# EAGLE design Production_Rev_A (EAGLE 9.1.3)
Battlab-One Production Rev. A 4/2020
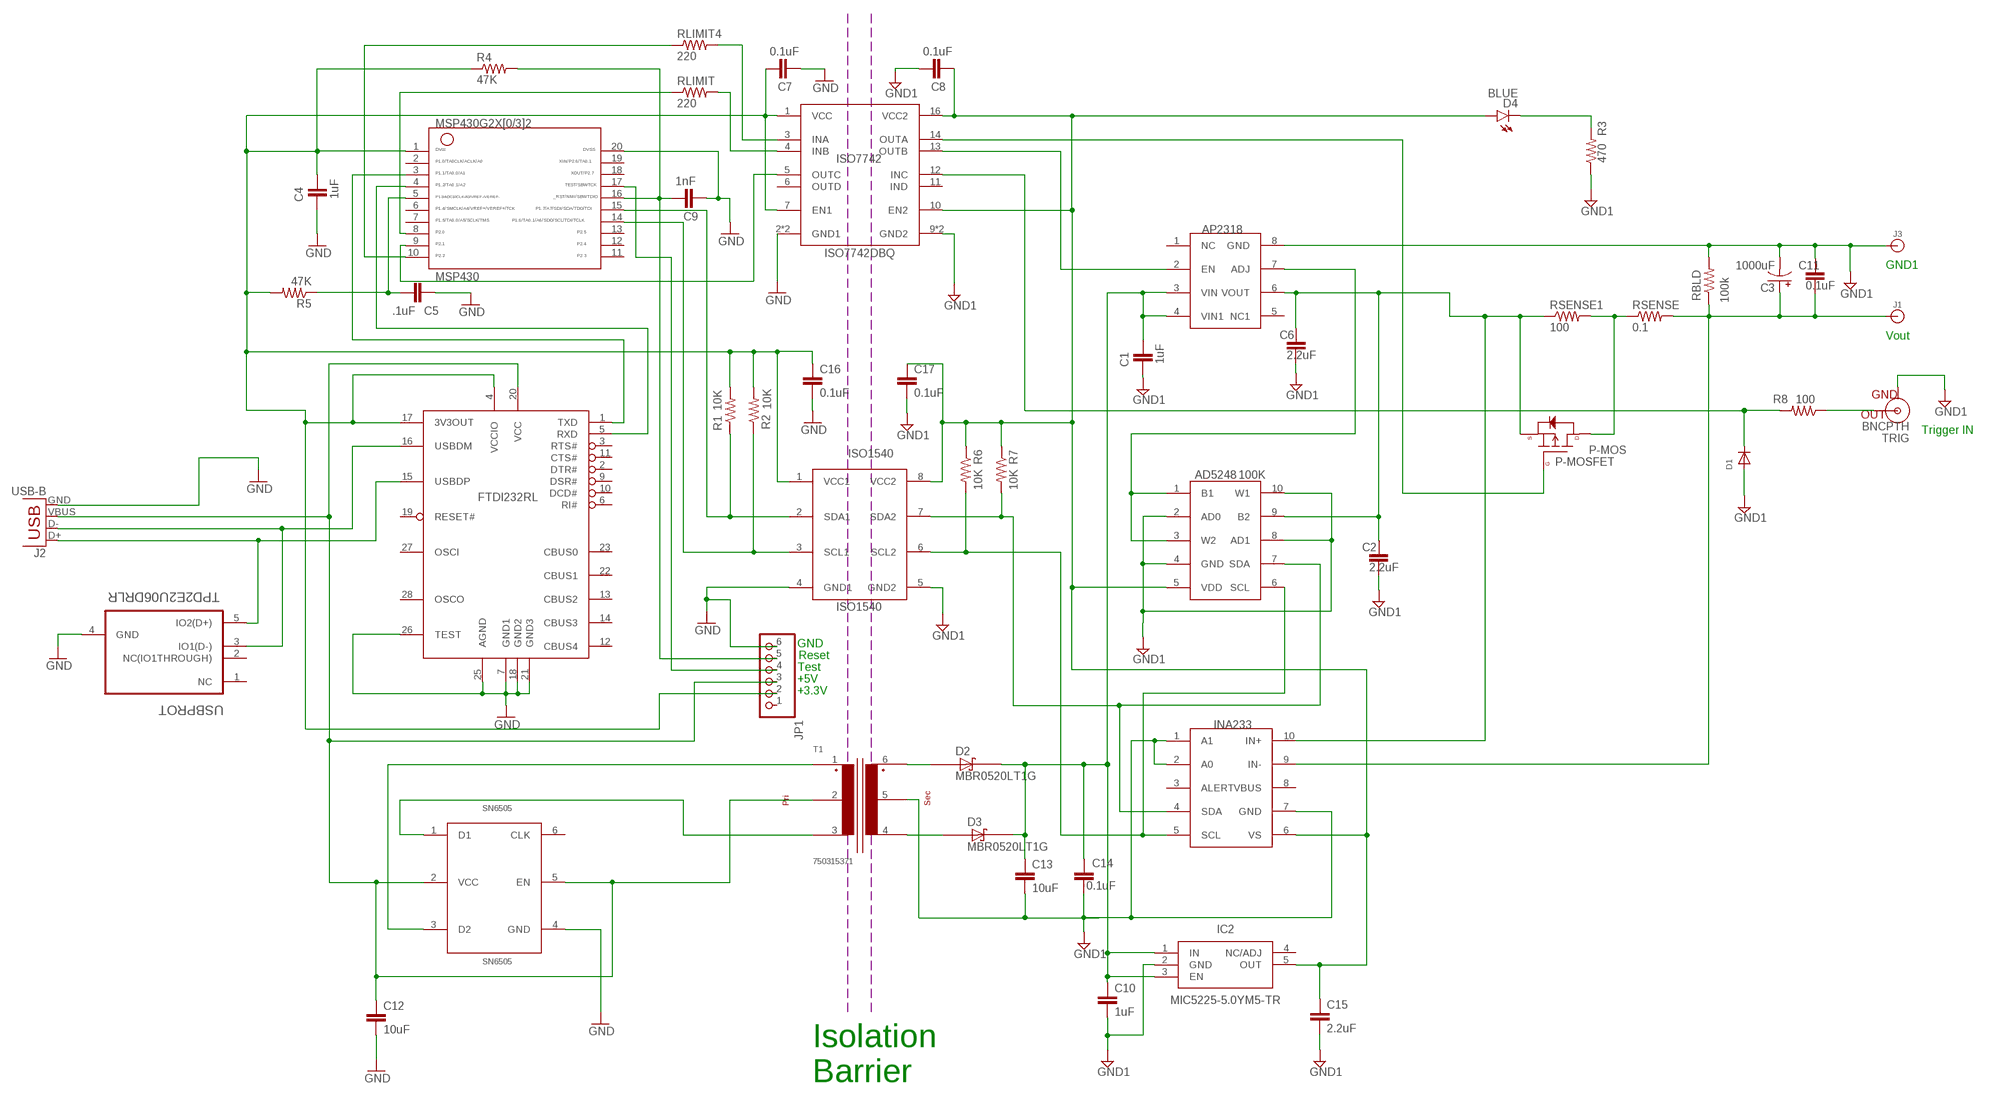
[diagram p0: schematic, sheet 1]

## Parts
AD5248  100K  AD5248  [MSOP-10]
AP2318  AP2318  [SOIC-8]
C1  1uF  CAP1206  [1206]
C2  2.2uF  CAP1206  [1206]
C3  1000uF  CPOL-USF  [PANASONIC_F]
C4  1uF  CAP1206  [1206]
C5  .1uF  CAP1206  [1206]
C6  2.2uF  CAP1206  [1206]
C7  0.1uF  CAP1206  [1206]
C8  0.1uF  CAP1206  [1206]
C9  1nF  CAP1206  [1206]
C10  1uF  CAP1206  [1206]
C11  0.1uF  CAP1206  [1206]
C12  10uF  CAP1206  [1206]
C13  10uF  CAP1206  [1206]
C14  0.1uF  CAP1206  [1206]
C15  2.2uF  CAP1206  [1206]
C16  0.1uF  CAP1206  [1206]
C17  0.1uF  CAP1206  [1206]
D1  DIODESOD-123  [SOD-123]
D2  MBR0520LT1G  [SOD3716X117(SOD-123)]
D3  MBR0520LT1G  [SOD3716X117(SOD-123)]
D4  BLUE  LED-BLUE1206  [LED-1206]
FTDI232RL  FT232RL  [SSOP28DB]
IC2  MIC5225-5.0YM5-TR  [SOT95P280X130-5N]
INA233  INA233  [VSSOP-10]
ISO1540  ISO1540  [SOIC127P600X175-8N]
ISO7742  ISO7742DBQ  [SOP63P599X175-16N]
J1  BANANA_CONN  [BANANA_CONN]
J2  USB-B  USBPTH  [USB-B-PTH]
J3  BANANA_CONN  [BANANA_CONN]
JP1  PINHD-1X6  [1X06]
MSP430  MSP430  G2X[0/3]2---PW20  [PW20]
P-MOS  P-MOSFET  P-CHANNEL-MOSFET  [SOT23-3]
R1  10K  RESISTOR1206  [1206]
R2  10K  RESISTOR1206  [1206]
R3  470  RESISTOR1206  [1206]
R4  47K  RESISTOR1206  [1206]
R5  47K  RESISTOR1206  [1206]
R6  10K  RESISTOR1206  [1206]
R7  10K  RESISTOR1206  [1206]
R8  100  RESISTOR1206  [1206]
RBLD  100k  RESISTOR1206  [1206]
RLIMIT  220  RESISTOR1206  [1206]
RLIMIT4  220  RESISTOR1206  [1206]
RSENSE  0.1  RESISTOR1206  [1206]
RSENSE1  100  RESISTOR1206  [1206]
SN6505  SN6505  [SOT95P280X145-6N]
T1  750315371  [TOR-6P-HT4_SMT_6PIN_(1201)]
TRIG  BNCPTH  [BNC]
USBPROT  TPD2E2U06DRLR  [SOT50P160X60-5N]

## Nets
3.3V: C4.2 C7.2 C16.1 FTDI232RL.4(VCCIO) FTDI232RL.17(3V3OUT) ISO1540.1(VCC1) ISO7742.1(VCC) ISO7742.7(EN1) JP1.2 MSP430.1 R1.2 R2.2 R4.1 R5.2
+5V_LDO: AD5248.5(VDD) C8.1 C15.1 C17.1 D4.A IC2.5(OUT) INA233.6(VS) ISO1540.8(VCC2) ISO7742.10(EN2) ISO7742.16(VCC2) R6.1 R7.1
GND: C4.1 C5.1 C7.1 C9.1 C12.2 C16.2 FTDI232RL.7(GND1) FTDI232RL.18(GND2) FTDI232RL.21(GND3) FTDI232RL.25(AGND) FTDI232RL.26(TEST) ISO1540.4(GND1) ISO7742.2(GND1) ISO7742.8(GND1) J2.GND JP1.6 MSP430.20 SN6505.4(GND) USBPROT.4(GND)
GND1: AD5248.2(AD0) AD5248.4(GND) AD5248.8(AD1) AD5248.10(W1) AP2318.8(GND) C1.1 C2.2 C3.- C6.2 C8.2 C10.2 C11.1 C13.2 C14.2 C15.2 C17.2 D1.A IC2.2(GND) INA233.1(A1) INA233.2(A0) INA233.7(GND) ISO1540.5(GND2) ISO7742.9(GND2) ISO7742.15(GND2) J3.P$1 R3.1 RBLD.2 T1.5 TRIG.GND
LDO_EN: ISO7742.4(INB) RLIMIT.2
LDO_EN1: MSP430.8 RLIMIT.1
LDO_EN2: AP2318.2(EN) ISO7742.13(OUTB)
N$4: P-MOS.3(D) RSENSE1.2 RSENSE.1
N$8: AP2318.3(VIN) AP2318.4(VIN1) C1.2 C10.1 C13.1 C14.1 D2.1(C) D3.1(C) IC2.1(IN) IC2.3(EN)
N$10: D3.2(A) T1.4
N$12: D2.2(A) T1.6
N$21: AD5248.1(B1) AD5248.3(W2) AP2318.7(ADJ)
N$29: D4.C R3.2
N$38: R8.1 TRIG.S(OUT)
RESET: C9.2 JP1.5 MSP430.16 R4.2
RS_EN: MSP430.10 RLIMIT4.1
RS_EN1: ISO7742.3(INA) RLIMIT4.2
RS_EN2: ISO7742.14(OUTA) P-MOS.1(G)
SCL1: ISO1540.3(SCL1) MSP430.14 R2.1
SCL2: AD5248.6(SCL) INA233.5(SCL) ISO1540.6(SCL2) R6.2
SDA1: ISO1540.2(SDA1) MSP430.15 R1.1
SDA2: AD5248.7(SDA) INA233.4(SDA) ISO1540.7(SDA2) R7.2
TEST: JP1.4 MSP430.17
TRANS1: SN6505.3(D2) T1.1
TRANS3: SN6505.1(D1) T1.3
TRIGGER_MSP1: ISO7742.5(OUTC) MSP430.9
TRIGGER_MSP2: D1.C ISO7742.12(INC) R8.2
UART_RX: FTDI232RL.5(RXD) MSP430.4
UART_TX: FTDI232RL.1(TXD) MSP430.3
USB+: FTDI232RL.15(USBDP) J2.D+ USBPROT.5(IO2(D+))
USB-: FTDI232RL.16(USBDM) J2.D- USBPROT.3(IO1(D-))
V_OUT: AD5248.9(B2) AP2318.6(VOUT) C2.1 C6.1 INA233.10(IN+) P-MOS.2(S) RSENSE1.1
VBUS+5V: C12.1 FTDI232RL.20(VCC) J2.VBUS JP1.3 SN6505.2(VCC) SN6505.5(EN) T1.2
VOUT: C3.+ C11.2 INA233.9(IN-) J1.P$1 RBLD.1 RSENSE.2
VREF: C5.2 MSP430.5 R5.1
Unconnected: AP2318.1(NC) AP2318.5(NC1) FTDI232RL.2(DTR#) FTDI232RL.3(RTS#) FTDI232RL.6(RI#) FTDI232RL.9(DSR#) FTDI232RL.10(DCD#) FTDI232RL.11(CTS#) FTDI232RL.12(CBUS4) FTDI232RL.13(CBUS2) FTDI232RL.14(CBUS3) FTDI232RL.19(RESET#) FTDI232RL.22(CBUS1) FTDI232RL.23(CBUS0) FTDI232RL.27(OSCI) FTDI232RL.28(OSCO) IC2.4(NC/ADJ) INA233.3(ALERT) INA233.8(VBUS) ISO7742.6(OUTD) ISO7742.11(IND) JP1.1 MSP430.2 MSP430.6 MSP430.7 MSP430.11 MSP430.12 MSP430.13 MSP430.18 MSP430.19 SN6505.6(CLK) USBPROT.2(NC(IO1THROUGH))

## Notes on the sheet
- GND1
- Vout
- Trigger IN
- GND
- Reset
- Test
- +5V
- +3.3V
- Isolation
  Barrier

## Power pins joined to a net without a drawn wire
NC: USBPROT.1(NC)

## Library data of the parts
AD5248 = BluebirdLabs:AD5248
AP2318 = BluebirdLabs:AP2318
C1 C2 C4-C17 = SparkFun-Capacitors:CAP: Capacitor Standard 0603 ceramic capacitor, and 0.1" leaded capacitor.
C3 = adafruit:CPOL-US: POLARIZED CAPACITOR, American symbol
D1 = adafruit:DIODE: Diode SMADIODE - SMA Surface Mount Package 20V 1A Schottky Diode Digikey: 641-1014-6-ND DO-1N4148 - Through Hole Small Current Diode SOD-123 20V 1 A (.5mV Vf) Schottky Diode - Digikey: MBRX120TPMSCT-ND SOD-323 10V 570mA (.38mV Vf, 3ns) Schottky Diode - Digikey: ZLLS410CT-ND SOD-523 30V 30mA Schottky Diode (RB751S-40TE61) - Digikey: RB751S-40TE61CT-ND SOT23-R/W - SOT23 Package (R = Solder Paste/Reflow Ovens, W = Hand-Soldering) BAT54Film 40V 300mA - Digikey: 497-7162-1-ND
D2 D3 = MBR0520LT1G:MBR0520LT1G: Surface Mount Schottky Power Rectifier Plastic SOD−123 Package; AVAILABILITY: Unavailable; DESCRIPTION: sod, pin, process, Schottky Diodes, repetitive, voltage, polarity, reflow, leaded, diode, Diodes, plastic, current, s...; MF: ON Semiconductor; MP: MBR0520LT1G; PACKAGE: SOD-123 Motorola; PRICE: None
D4 = SparkFun-LED:LED-BLUE: Blue LEDs for production use Various blue LEDs stocked by SparkFun production 0603 - DIO-08575 Rebel - DIO-09553 1206 - DIO-09911; PROD_ID: DIO-09911
FTDI232RL = ftdichip-6:FT232RL: USB UART 4th Generation USB UART (USB <-> Serial) Controller
IC2 = MIC5225-5.0YM5-TR:MIC5225-5.0YM5-TR: MICROCHIP - MIC5225-5.0YM5-TR - LDO VOLT REG, 0.15A, 5V, SOT-23-5 <https://componentsearchengine.com/Images/9/MIC5225-5.0YM5-TR.jpg> Source: Datasheet <http://ww1.microchip.com/downloads/en/DeviceDoc/mic5225.pdf>; AVAILABILITY: Unavailable; DESCRIPTION: Linear Voltage Regulator IC 1 Output 150mA SOT-23-5; MF: Microchip; MP: MIC5225-5.0YM5-TR; PACKAGE: SOT-23-5 Microchip; PRICE: None
INA233 = BluebirdLabs:INA233: Texas Instruments current measurement
ISO1540 = SOIC127P600X175-8N:ISO1540
ISO7742 = ISO7742DBQ:ISO7742DBQ: High-Efficiency, Low-Emissions, Reinforced Digital Isolator With Integrated Power 16-SOIC -40 to 125; AVAILABILITY: Unavailable; DESCRIPTION: ISO7742DBQ; MF: Texas Instruments; MP: ISO7742DBQ; PACKAGE: SSOP-16 Texas Instruments; PRICE: None
J1 J3 = SparkFun-Connectors:BANANA_CONN: Through-hole banana jack
J2 = SparkFun-Connectors:USB: USB Connectors USB-B-PTH is fully proven SKU : PRT-00139/CONN-08278 USB-miniB is fully proven SKU : PRT-00587 USB-A-PCB is untested. USB-A-H is throughly reviewed, but untested. Spark Fun Electronics SKU : PRT-00437 USB-B-SMT is throughly reviewed, but untested. Needs silkscreen touching up. USB-A-S has not been used/tested USB-MB-H has not been used/tested USB-MICROB has been used. CONN-09505; PROD_ID: CONN-08278
JP1 = adafruit:PINHD-1X6: PIN HEADER
MSP430 = TI_MSP430_v16:G2X[0/3]2---PW20: MSP430G2X[0/3]2 MSP430G2x32, MSP430G2x02 TSSOP (PW) 20 Pin Package http://focus.ti.com/docs/prod/folders/print/msp430g2432.html
P-MOS = GeekAmmo:P-CHANNEL-MOSFET: P-Channel MOSFET Mode Field Effect Transistor
R1-R8 RBLD = SparkFun-Passives:RESISTOR: Resistor Basic schematic elements and footprints for 0603, 1206, and PTH resistors.
RLIMIT RLIMIT4 RSENSE RSENSE1 = SparkFun-Resistors:RESISTOR: Resistor Basic schematic elements and footprints for 0603, 1206, and PTH resistors.
SN6505 = SN6505:SN6505
T1 = 750315371:750315371: Package Style: TOR-6P-HT4 Mounting: SMT Pins: 6 pins Bobbin: 250-1201 Best pinouts for production vary per application. Please contact Wurth Electronics Midcom, Inc. for assistance with your custom design. Website: Wurth Electronics Midcom <http://www.we-online.com/midcom> Contact us Wurth Electronics Midcom, Inc. 121 Airport Dr. Watertown, SD 57201 Phone: (605) 886-4385 Fax: (605) 886-4486 E-Mail: midcom@we-online.com; AVAILABILITY: Unavailable; DESCRIPTION: Xfrmr Fwd p-p Dc/Dc Conv Smd; MF: Wurth Electronics; MP: 750315371; PACKAGE: Wurth Electronics; PRICE: None
TRIG = SparkFun-Connectors:BNC: BNC Connector, Mouser Part# 5227161
USBPROT = TPD2E2U06DRLR:TPD2E2U06DRLR: LOW-CAPACITANCE 2-CHANNEL ±25kv contact and +/-30kv air gap protection for USB2.0, ethernet, MIPI, LVDS, and I2C TESTED; AVAILABILITY: Unavailable; DESCRIPTION: Dual-Channel High-Speed ESD Protection 5-SOT -40 to 125; MF: Texas Instruments; MP: TPD2E2U06DRLR; PACKAGE: SOT-553 Texas Instruments; PRICE: None

## Board
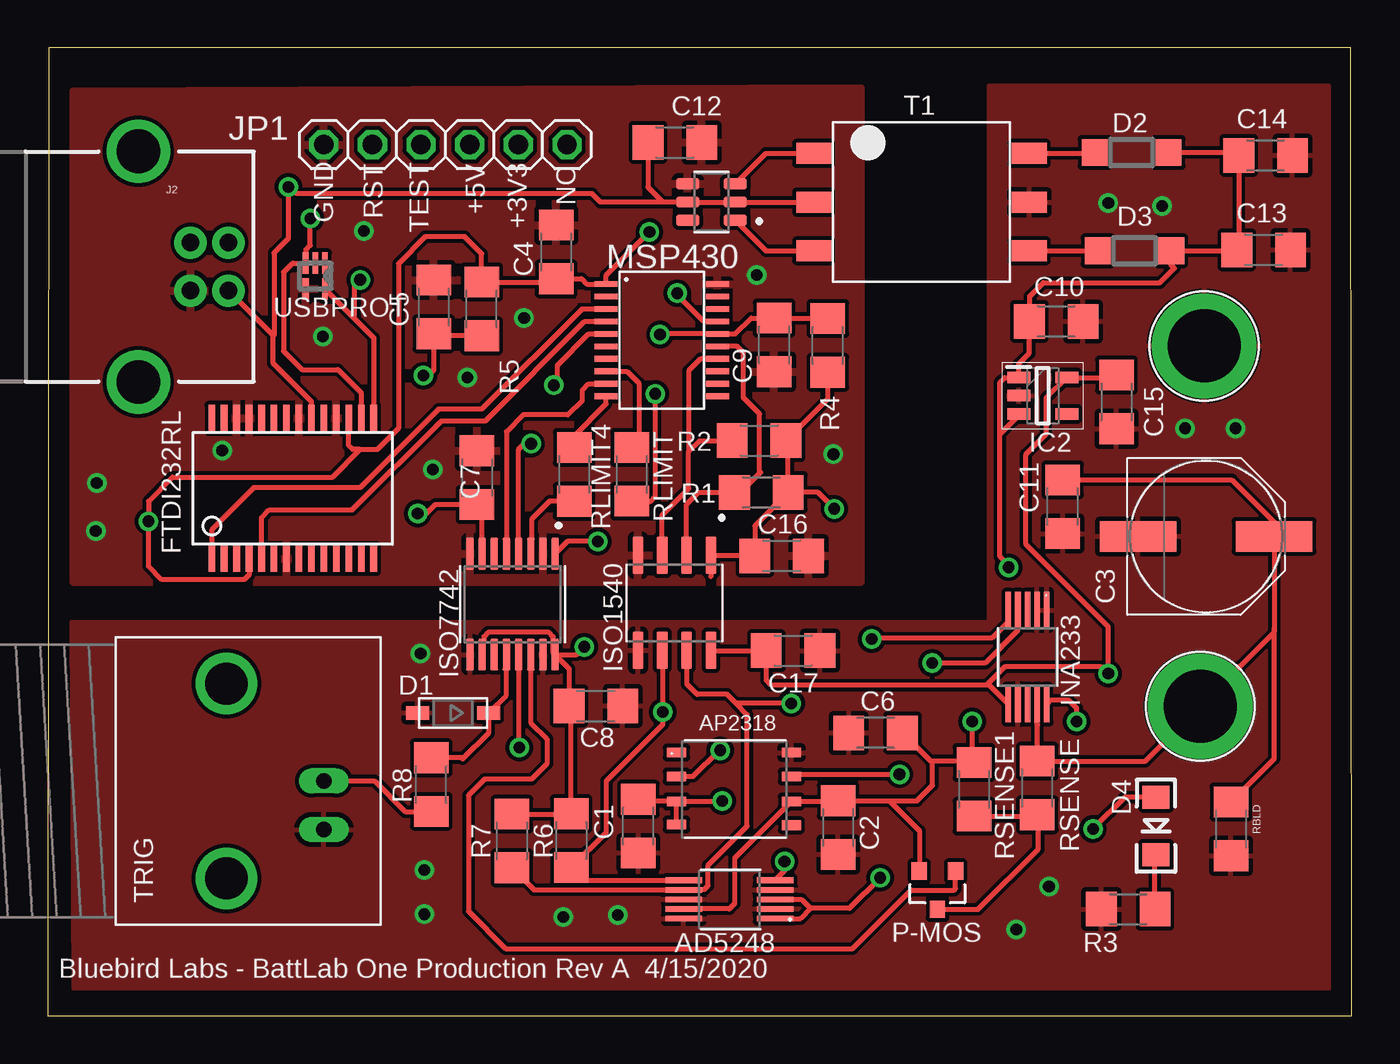
[diagram p1: board, top side]
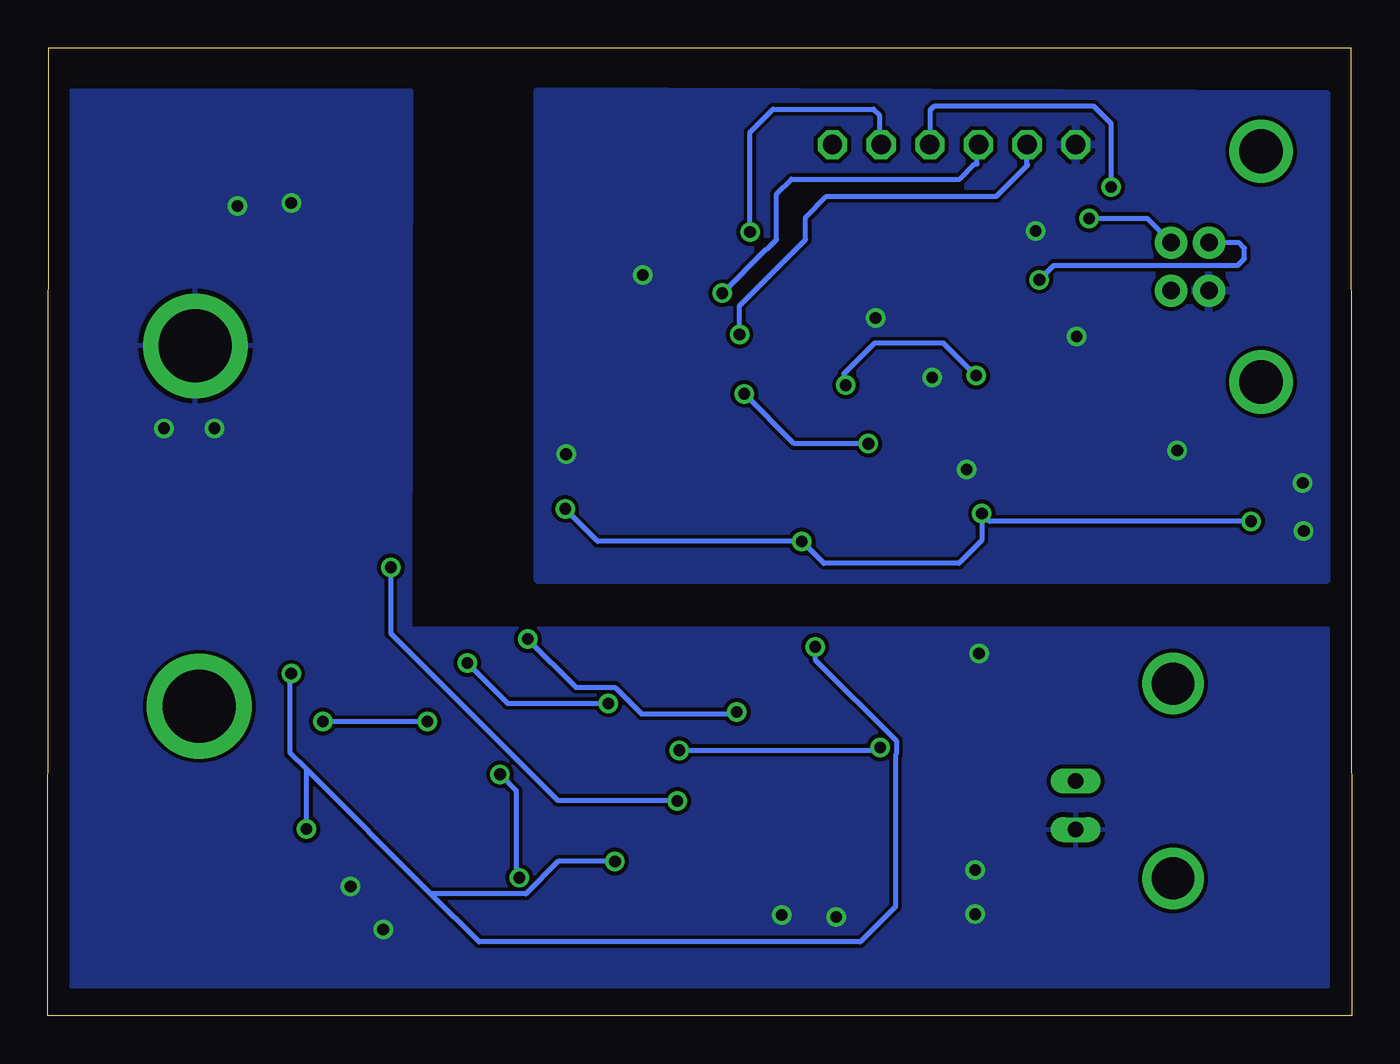
[diagram p2: board, bottom side, seen from below]

Size 68.05 x 50.5 mm. Coordinates in mm from the lower left corner, seen from the top.
Outline: 0,0 68.05,0 68,50.5 0.05,50.5 0,0
Copper layers (1*16): Top 0.035mm / dielectric 1.5mm / Bottom 0.035mm
Design rules "default": minimum track width 10mil, minimum drill 24mil, track to track 8mil, track to pad 8mil, pad to pad 8mil, via to via 8mil, smd to smd 8mil, copper to edge 40mil, drill to drill 8mil, minimum pad ring 10mil, minimum via ring 8mil, stop-mask expansion 4mil, vias tented up to drill 0mil, thermal gap 10mil

### Footprints (pad centres in the part's own frame; a part is rotated, then mirrored left to right if it is on the bottom)
MSOP-10 = smd 0.29 x 1.905: 1 -1,-2.327; 2 -0.5,-2.327; 3 0,-2.327; 4 0.5,-2.327; 5 1,-2.327; 6 1,2.454; 7 0.5,2.454; 8 0,2.454; 9 -0.5,2.454; 10 -1,2.454
SOIC-8 = smd 0.51 x 1: 1 -1.9,-3; 2 -0.65,-3; 3 0.65,-3; 4 1.85,-3; 5 1.9,3; 6 0.65,3; 7 -0.65,3; 8 -1.9,3
1206 = smd 1.6 x 1.8: 1 -1.4,0; 2 1.4,0
PANASONIC_F = smd 4 x 1.6: + 3.55,0; - -3.55,0
SOD-123 = smd 1.2 x 0.7: A 1.85,0; C -1.85,0
SOD3716X117(SOD-123) = smd 1.4 x 1.4: 1 -1.9,0.051; 2 1.9,0.051
LED-1206 = smd 1.2 x 1.4: A -1.5,0; C 1.5,0
SSOP28DB = smd 0.348 x 1.397: 1 -4.225,-3.656; 2 -3.575,-3.656; 3 -2.925,-3.656; 4 -2.275,-3.656; 5 -1.625,-3.656; 6 -0.975,-3.656; 7 -0.325,-3.656; 8 0.325,-3.656; 9 0.975,-3.656; 10 1.625,-3.656; 11 2.275,-3.656; 12 2.925,-3.656; 13 3.575,-3.656; 14 4.225,-3.656; 15 4.225,3.656; 16 3.575,3.656; 17 2.925,3.656; 18 2.275,3.656; 19 1.625,3.656; 20 0.975,3.656; 21 0.325,3.656; 22 -0.325,3.656; 23 -0.975,3.656; 24 -1.625,3.656; 25 -2.275,3.656; 26 -2.925,3.656; 27 -3.575,3.656; 28 -4.225,3.656
SOT95P280X130-5N = smd 1.2 x 0.6: 1 -1.25,0.95; 2 -1.25,0; 3 -1.25,-0.95; 4 1.25,-0.95; 5 1.25,0.95
VSSOP-10 = smd 0.29 x 1.905: 1 -1,-2.454; 2 -0.5,-2.454; 3 0,-2.454; 4 0.5,-2.454; 5 1,-2.454; 6 1,2.454; 7 0.5,2.454; 8 0,2.454; 9 -0.5,2.454; 10 -1,2.454
SOIC127P600X175-8N = smd 1.97 x 0.57: 1 -2.475,1.905; 2 -2.475,0.635; 3 -2.475,-0.635; 4 -2.475,-1.905; 5 2.475,-1.905; 6 2.475,-0.635; 7 2.475,0.635; 8 2.475,1.905
SOP63P599X175-16N = smd 1.65 x 0.41: 1 -2.63,2.223; 2 -2.63,1.587; 3 -2.63,0.953; 4 -2.63,0.318; 5 -2.63,-0.318; 6 -2.63,-0.953; 7 -2.63,-1.587; 8 -2.63,-2.223; 9 2.63,-2.223; 10 2.63,-1.587; 11 2.63,-0.953; 12 2.63,-0.318; 13 2.63,0.318; 14 2.63,0.953; 15 2.63,1.587; 16 2.63,2.223
BANANA_CONN = drill 3.81 pad 5.461: P$1 0,0
USB-B-PTH = drill 0.914 pad 1.676: D+ 0,1.25; D- 1.981,1.25; GND 0,-1.25; VBUS 1.981,-1.25 | drill 2.286: S1 -2.718,-6.02; S2 -2.718,6.02
1X06 = drill 1.016 octagon: 1 -6.35,0; 2 -3.81,0; 3 -1.27,0; 4 1.27,0; 5 3.81,0; 6 6.35,0
PW20 = smd 0.3 x 1.2: 1 -2.925,-2.9; 2 -2.275,-2.9; 3 -1.625,-2.9; 4 -0.975,-2.9; 5 -0.325,-2.9; 6 0.325,-2.9; 7 0.975,-2.9; 8 1.625,-2.9; 9 2.275,-2.9; 10 2.925,-2.9; 11 2.925,2.9; 12 2.275,2.9; 13 1.625,2.9; 14 0.975,2.9; 15 0.325,2.9; 16 -0.325,2.9; 17 -0.975,2.9; 18 -1.625,2.9; 19 -2.275,2.9; 20 -2.925,2.9
SOT23-3 = smd 0.8 x 0.9: 1 -0.95,-1; 2 0.95,-1; 3 0,1
SOT95P280X145-6N = smd 1.22 x 0.6: 1 -1.245,0.95; 2 -1.245,0; 3 -1.245,-0.95; 4 1.245,-0.95; 5 1.245,0; 6 1.245,0.95
TOR-6P-HT4_SMT_6PIN_(1201) = smd 1.829 x 1.092: 1 -5.626,2.54; 2 -5.626,0; 3 -5.626,-2.54; 4 5.626,-2.54; 5 5.626,0; 6 5.626,2.54
BNC = drill 2.2: 3 -5.08,5.08; 4 5.08,5.08 | drill 0.8 long: GND -2.54,0; S 0,0
SOT50P160X60-5N = smd 1.118 x 0.3: 1 -0.675,0.508; 2 -0.675,0; 3 -0.675,-0.508; 4 0.675,-0.5; 5 0.675,0.5

### Placement (x,y rotation side)
AD5248  35.63,6.07 90 top
AP2318  35.81,11.83 270 top
C1  30.82,9.9 90 top
C2  41.24,9.82 270 top
C3  60.45,25.01 0 top
C4  26.53,39.86 270 top
C5  20.14,36.98 270 top
C6  43.21,14.76 180 top
C7  22.4,28.08 270 top
C8  28.61,16.16 0 top
C9  37.91,35.01 90 top
C10  52.63,36.24 0 top
C11  52.97,26.56 90 top
C12  32.72,45.57 0 top
C13  63.46,39.97 0 top
C14  63.56,44.89 0 top
C15  55.77,32.03 270 top
C16  38.3,24 0 top
C17  38.9,19.05 0 top
D1  21.15,15.8 180 top
D2  56.57,45.1 180 top
D3  56.72,39.97 180 top
D4  57.84,9.91 270 top
FTDI232RL  12.78,27.51 0 top
IC2  51.93,32.35 0 top
INA233  51.13,18.72 180 top
ISO1540  32.7,21.54 270 top
ISO7742  24.25,21.47 270 top
J1  60.15,16.15 0 top
J2  7.44,39.09 0 top
J3  60.35,34.95 0 top
JP1  20.75,45.45 180 top
MSP430  32.04,35.25 270 top
P-MOS  46.43,6.55 180 top
R1  37.24,27.31 0 top
R2  37.12,30.01 0 top
R3  56.39,5.56 0 top
R4  40.71,34.98 90 top
R5  22.64,36.88 90 top
R6  27.32,9.14 270 top
R7  24.22,9.12 270 top
R8  20,12.06 90 top
RBLD  61.75,9.75 270 top
RLIMIT  30.47,28.25 270 top
RLIMIT4  27.47,28.25 270 top
RSENSE  51.64,11.88 90 top
RSENSE1  1000  [1206]  48.34,11.81 270 top
SN6505  34.64,42.46 180 top
T1  45.6,42.46 0 top
TRIG  14.4,12.25 90 top
USBPROT  13.96,38.6 270 top

### Tracks (layer width: path | path; a pad name or v marks a point on that pad's centre or on a via)
3.3V  (via drill 0.61)
  Top 0.254: 26.5,24.08 ISO7742.1 27.12,24.75 v28.7,24.75 | 34.61,22.91 ISO1540.1 36.88,24.02 C16.1 | v31.4,40.9 29.14,38.64 MSP430.1 28.12,38.17 27.84,38.46 C4.2 26.35,38.28 R5.2 22.64,39.76 21.75,40.65 19.7,40.65 18.3,39.25 18.3,30.65 17.2,29.55 16.3,29.55 | C16.1 36.9,24.35 | R4.1 40.71,32.19 R2.2 38.64,29.89 R1.2 | v41.05,26.45 40.19,27.31 R1.2 | R1.2 36.9,25.57 C16.1 | 19.23,26.27 v19.3,26.2 19.75,26.2 20.23,26.68 C7.2 22.66,26.41 ISO7742.7 | 16.3,29.55 15.9,29.55 15.7,29.75 FTDI232RL.17 | 16.3,29.55 14.85,28.1 6.5,28.1 5.25,26.85 v5.25,25.8 5.25,23.45 5.95,22.75 10.25,22.75 10.51,23 FTDI232RL.4
  Bottom 0.254: v31.4,40.9 31.4,46.1 30.2,47.3 24.95,47.3 24.65,47 24.65,45.54 JP1.2 | v41.05,26.45 39.35,24.75 v28.7,24.75 27.55,23.6 20.5,23.6 19.3,24.8 v19.3,26.2 | 19.2,26.3 v19.3,26.2 | v5.25,25.8 18.9,25.8 v19.3,26.2
+5V_LDO  (via drill 0.61)
  Top 0.254: ISO7742.16 26.38,18.94 26.38,19.78 26.15,20 22.99,20 22.76,19.78 22.76,19.51 22.6,19.35 22.66,19.29 ISO7742.10 | ISO7742.16 27.21,18.11 27.21,16.35 | 27.21,16.35 C8.1 | INA233.6 49.14,17.25 49,17.25 | 49,17.25 37.75,17.25 37.5,17.5 C17.1 34.62,19.05 ISO1540.8 | 49,17.25 49.95,18.2 53.55,18.2 | R6.1 27.32,10.65 | 27.32,10.65 27.32,16.24 27.21,16.35 | R7.1 27.19,10.52 27.32,10.65 | AD5248.5 38.45,7.56 v38.45,8.05 | 53.55,18.2 55,18.2 v55.35,17.85 55.35,20.3 51.05,24.6 51.05,29.3 52.1,30.35 52.1,32.22 IC2.5 55.64,33.3 C15.1 | ISO7742.16 27.59,18.84 v28,19.25 | 53.55,18.25 53.55,18.2 | D4.A 56.21,11.41 v54.55,9.75 54.45,9.65
  Bottom 0.254: v38.45,8.05 41.41,8.05 43.1,6.36 48.06,6.36 | v55.35,17.85 55.4,17.9 55.4,13.7 54.55,12.85 | 48.06,6.36 54.55,12.85 | 48.06,6.36 45.55,3.85 25.65,3.85 23.8,5.7 23.8,13.62 23.76,13.65 23.76,14.35 28,18.59 v28,19.25 | v54.55,9.75 54.55,12.85
GND  (via drill 0.61)
  other vias: 14.35,35.45 16.5,40.95 37,38.65 9.1,29.5 20.1,28.5 24.85,36.4 21.9,33.3 41,29.3 2.55,27.8 2.5,25.3
  pour Bottom: 1.29,48.07 42.52,48.24 42.52,22.75 1.29,22.75
  pour Top: 1.34,48.25 42.42,48.42 42.42,22.62 1.34,22.62
GND1  (via drill 0.61)
  other vias: 19.45,18.9 26.9,5.15 29.75,5.25 55.35,42.4 58.15,42.25 19.65,7.6 19.65,5.3 50.55,4.5 52.25,6.75 62,30.65 59.35,30.65
  pour Top: 1.3,1.4 66.9,1.4 66.9,48.55 49.07,48.55 49.07,20.57 1.2,20.57
  pour Bottom: 49.05,48.28 66.86,48.28 66.86,1.5 65.8,1.5 1.2,1.5 1.2,1.55 1.2,20.22 49.1,20.22
LDO_EN  (via drill 0.61)
  Top 0.254: ISO7742.4 24.57,29.57 24.85,29.85 v25.22,29.85 | v31.7,32.45 31.7,27.1 31.4,26.8 31.35,26.85 RLIMIT.2
  Bottom 0.254: v25.22,29.85 29.1,29.85 v31.7,32.45
LDO_EN1
  Top 0.254: MSP430.8 30.23,33.62 30.85,33 30.85,30.03 RLIMIT.1
LDO_EN2  (via drill 0.61)
  Top 0.254: AP2318.2 33.68,12.48 35.05,13.85 v35.1,13.85 | v24.6,14 24.6,18.81 ISO7742.13
  Bottom 0.254: v35.1,13.85 24.75,13.85 v24.6,14
N$4
  Top 0.254: P-MOS.3 48.55,5.55 51.7,8.7 51.7,10.43 RSENSE.1 51.57,10.41 RSENSE1.2
N$8  (via drill 0.61)
  Top 0.254: AP2318.3 32.84,11.15 32.81,11.12 AP2318.4 | AP2318.3 30.93,11.18 C1.2 | D2.1 62.01,45.05 C14.1 62.16,40.07 C13.1 62.01,39.91 D3.1 58.62,39.18 58.8,39 58.05,38.25 51.95,38.25 51.25,37.55 51.25,36.26 C10.1 51.23,34.58 50.68,34.03 IC2.1 49.95,33.3 49.7,33.05 49.7,30.35 | IC2.3 50.72,31.37 49.7,30.35 | AP2318.3 35.18,11.18 v35.2,11.2 | v50.15,23.4 50.15,23.5 49.7,23.95 49.7,30.35
  Bottom 0.254: v50.15,23.4 50.15,19.95 41.45,11.25 35.2,11.25 35.15,11.2 v35.2,11.2
N$10
  Top 0.254: D3.2 T1.4
N$12
  Top 0.254: T1.6 54.62,45 D2.2
N$21  (via drill 0.61)
  Top 0.254: AD5248.1 39.27,5.07 39.8,5.6 | AD5248.3 39.33,6.07 39.8,5.6 | AP2318.7 38.92,12.6 v44.45,12.6 | v43.45,7.2 41.85,5.6 39.8,5.6
  Bottom 0.254: v44.45,12.6 43.6,11.75 43.6,7.3 43.5,7.2 v43.45,7.2
N$29
  Top 0.254: R3.2 57.79,8.36 D4.C
N$38
  Top 0.254: TRIG.S 17.05,12.25 18.65,10.65 R8.1
RESET  (via drill 0.61)
  Top 0.254: R4.2 40.68,36.41 C9.2 36.71,36.41 35.88,35.58 MSP430.16 31.93,35.58 31.9,35.55 v31.95,35.55
  Bottom 0.254: v31.95,35.55 31.95,37.05 28.5,40.5 28.5,41.65 27.4,42.75 18.55,42.75 16.9,44.4 16.94,44.44 JP1.5
RS_EN
  Top 0.254: MSP430.10 29.14,31.92 27.47,30.25 RLIMIT4.1
RS_EN1
  Top 0.254: RLIMIT4.2 26.2,26.85 25.25,25.9 25.25,24.15 ISO7742.3
RS_EN2
  Top 0.254: ISO7742.14 25.2,15.3 26.05,14.45 26.05,13.15 25.25,12.35 22.8,12.35 21.95,11.5 21.95,5.45 23.9,3.5 42,3.5 45.05,6.55 47.3,6.55 47.38,6.63 P-MOS.1
SCL1
  Top 0.254: ISO1540.3 32.07,26.12 33.45,27.5 33.45,29.45 | 33.45,29.45 34,30 35.72,30 R2.1 | MSP430.14 34.08,34.27 33.45,33.65 33.45,29.45
SCL2  (via drill 0.61)
  Top 0.254: v43,19.65 42.95,19.65 v43,19.65 | ISO1540.6 32.1,19.03 v32.1,15.85 32.1,15.2 29.15,12.25 29.15,9.57 R6.2 27.98,7.07 AD5248.6 | INA233.5 50.13,20.57 49.26,19.7 43.05,19.7 v43,19.65
  Bottom 0.254: v43,19.65 40.49,17.14 38.45,17.14 37.06,15.75 32.05,15.75 32.05,15.8 v32.1,15.85
SDA1
  Top 0.254: ISO1540.2 33.34,26.69 33.96,27.31 R1.1 36.16,27.31 37.2,28.35 37.15,28.4 37.15,31.4 36.3,32.25 36.3,34.6 35.98,34.92 MSP430.15
SDA2  (via drill 0.61)
  Top 0.254: ISO1540.7 33.35,19.05 33.35,17.3 33.88,16.77 35.45,16.77 35.91,16.31 | 35.91,16.31 36.5,15.72 36.5,9.89 34.46,7.85 34.46,6.79 34.27,6.59 33.2,6.59 AD5248.7 25.37,6.57 R7.2 | INA233.4 50.61,21.14 50.61,20.08 48.93,18.4 v46.15,18.4 | v46.15,18.4 46.2,18.45 v46.15,18.4 | v38.8,16.3 35.92,16.3 35.91,16.31
  Bottom 0.254: v46.15,18.4 44.05,16.3 v38.8,16.3
TEST  (via drill 0.61)
  Top 0.254: MSP430.17 34.23,36.23 32.75,37.7 v32.85,37.7
  Bottom 0.254: v32.85,37.7 30.54,40.01 30.5,40.01 30.01,40.5 30.01,42.89 29.25,43.65 20.45,43.65 19.65,44.45 19.55,44.45 19.55,45.38 JP1.4
TRANS1
  Top 0.254: SN6505.3 37.47,45 T1.1
TRANS3
  Top 0.254: SN6505.1 37.47,39.92 T1.3
TRIGGER_MSP1
  Top 0.254: MSP430.9 28.23,32.98 27.9,32.65 27.9,32.1 27.15,31.35 24.8,31.35 23.93,30.48 ISO7742.5
TRIGGER_MSP2
  Top 0.254: R8.2 21.59,13.46 21.65,13.4 23,14.75 D1.C 23.93,16.73 ISO7742.12
UART_RX
  Top 0.254: FTDI232RL.5 11.15,26 11.55,26.39 15.89,26.39 20.54,31.04 22.84,31.04 28.02,36.23 MSP430.4
UART_TX
  Top 0.254: MSP430.3 27.88,36.88 22.65,31.65 20.4,31.65 16.3,27.55 10.75,27.55 8.55,25.35 FTDI232RL.1
USB+  (via drill 0.61)
  Top 0.254: 16,36.38 17,35.38 FTDI232RL.15 | 16,36.38 16,38.05 16.3,38.35 v16.3,38.4 | USBPROT.5 16,36.38
  Bottom 0.254: v16.3,38.4 15.55,39.15 5.95,39.15 5.6,39.5 5.6,40.05 5.9,40.35 5.91,40.34 J2.D+
USB-  (via drill 0.61)
  Top 0.254: v13.7,41.6 13.7,40.2 13.48,39.97 13.48,39.3 USBPROT.3 12.78,39.28 12.3,38.8 12.3,34.67 13.27,33.71 15.14,33.71 16.36,32.49 FTDI232RL.16 16.36,31.31
  Bottom 0.254: v13.7,41.6 10.69,41.6 J2.D-
V_OUT  (via drill 0.61)
  Top 0.254: 43.92,11.22 45.37,11.22 46.17,12.02 46.17,13.3 | C6.1 46.07,13.3 46.17,13.3 | 46.17,13.3 46.35,13.3 47,13.3 48.25,13.3 RSENSE1.1 48.25,13.3 v48.25,15.35 | v53.7,15.35 53.7,16.05 53.3,16.45 52.32,16.45 INA233.10 | AD5248.9 35.57,5.57 35.85,5.85 35.85,8.23 AP2318.6 41.21,11.18 C2.1 43.92,11.22 | 43.92,11.22 45.48,9.66 P-MOS.2
  Bottom 0.254: v48.25,15.35 53.6,15.35 53.7,15.45 v53.7,15.35
VBUS+5V  (via drill 0.61)
  Top 0.254: T1.2 SN6505.2 SN6505.5 32.1,42.46 | C12.1 31.32,43.23 32.1,42.46 | 32.1,42.46 28.84,42.46 28.4,42.9 13,42.9 12.55,43.35 | 12.5,43.4 12.55,43.35 | 12.55,43.35 v12.55,43.25 12.55,40.55 11.8,39.8 11.8,35.5 11.76,35.5 | J2.VBUS 11.76,35.5 | 13.8,31.21 FTDI232RL.20 13.76,32.05 11.76,34.04 11.76,35.5
  Bottom 0.254: v12.55,43.25 12.55,46.55 13.45,47.45 21.8,47.45 22,47.25 22,45.47 JP1.3
VOUT
  Top 0.254: INA233.9 51.63,15.22 51.66,15.2 51.66,15.16 51.64,15.14 RSENSE.2 57.28,13.28 J1.P$1 64,20 64,20.2 | C11.2 61.79,27.96 64,25.75 C3.+ 64,20.2 | RBLD.1 64,13.4 64,20.2
VREF  (via drill 0.61)
  Top 0.254: R5.1 20.24,35.48 C5.2 20.14,33.69 19.85,33.4 v19.6,33.4 | MSP430.5 28.23,35.58 26.6,33.95 26.6,33.1 v26.4,32.9
  Bottom 0.254: v26.4,32.9 26.4,32.85 26.5,32.75 26.5,33.5 24.9,35.1 21.3,35.1 v19.6,33.4

### Text on the board
tPlace: RST | +5V | NC | GND | TEST | +3V3 | Bluebird Labs - BattLab One Production Rev A 4/15/2020